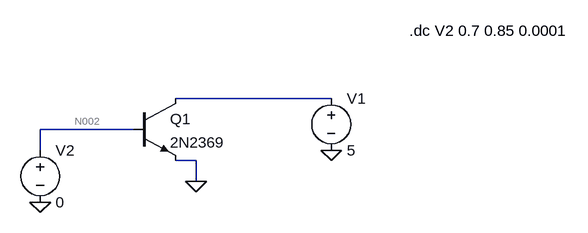
[diagram p0: schematic Draft1.asc]
Draft1.asc, the LTspice schematic file:
Version 4
SHEET 1 1112 680
WIRE 576 96 336 96
WIRE 272 144 128 144
WIRE 128 176 128 144
WIRE 368 192 336 192
WIRE 368 224 368 192
FLAG 576 176 0
FLAG 368 224 0
FLAG 128 256 0
SYMBOL npn 272 96 R0
SYMATTR InstName Q1
SYMATTR Value 2N2369
SYMBOL voltage 576 80 R0
WINDOW 123 0 0 Left 0
WINDOW 39 0 0 Left 0
SYMATTR InstName V1
SYMATTR Value 5
SYMBOL voltage 128 160 R0
WINDOW 123 0 0 Left 0
WINDOW 39 0 0 Left 0
SYMATTR InstName V2
SYMATTR Value 0
TEXT 696 -8 Left 2 !.dc V2 0.7 0.85 0.0001

The netlist it stands for:
* Draft1.asc
Q1 N001 N002 0 0 2N2369
V1 N001 0 5
V2 N002 0 0
.model NPN NPN
.model PNP PNP
.lib standard.bjt
.dc V2 0.7 0.85 0.0001
.backanno
.end

* Results of the author's LTspice run, read from the files saved beside the schematic
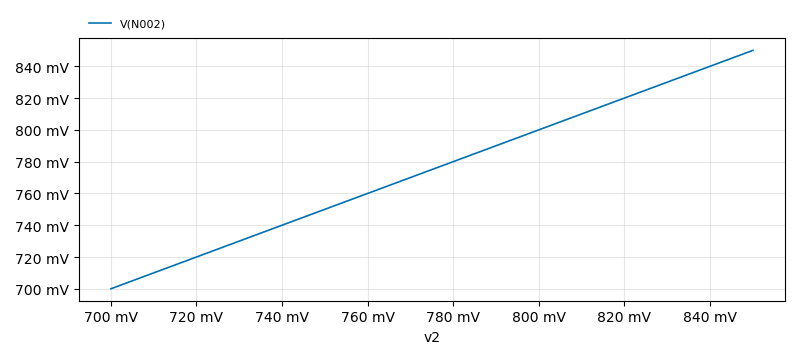
[diagram p1: DC transfer characteristic of Draft1.asc, plotted from the saved traces]
* DC transfer characteristic, 1 run:
*   V(N002): 700 mV at v2=700 mV, 850 mV at v2=850 mV, min 700 mV, max 850 mV